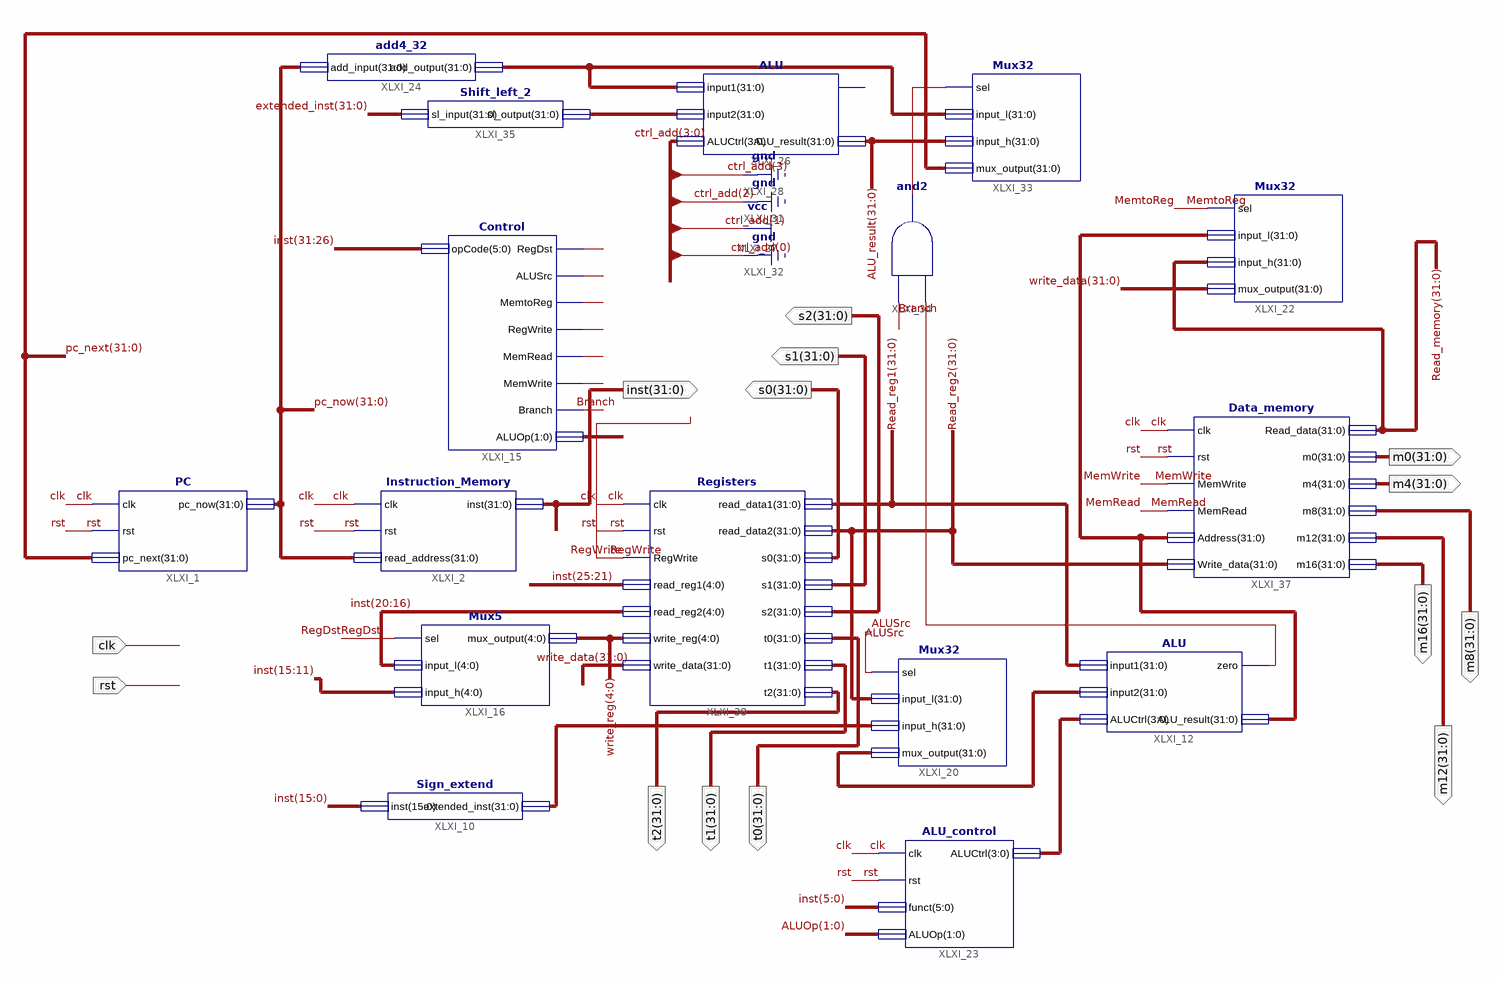
[diagram p0: schematic sheet 1]
// Xilinx ISE schematic theProcessor.sch (xa9500xl) as structural Verilog: 16 symbols, 14 ports
module theProcessor (
  input  clk,
  input  rst,
  output [31:0] inst,
  output [31:0] m0,
  output [31:0] m4,
  output [31:0] m8,
  output [31:0] m12,
  output [31:0] m16,
  output [31:0] t2,
  output [31:0] t1,
  output [31:0] t0,
  output [31:0] s2,
  output [31:0] s1,
  output [31:0] s0
);

  wire ALUSrc, Branch, MemRead, MemtoReg, MemWrite, RegDst, RegWrite, XLXN_137, XLXN_139;
  wire [1:0] ALUOp;
  wire [3:0] XLXN_101;
  wire [4:0] write_reg;
  wire [31:0] ALU_result, extended_inst, pc_next, pc_now, Read_memory, Read_reg1, Read_reg2, write_data,
       XLXN_63, XLXN_66, XLXN_132, XLXN_144;

  PC XLXI_1 (.clk(clk), .rst(rst), .pc_next(pc_next), .pc_now(pc_now));
  Instruction_Memory XLXI_2 (.clk(clk), .rst(rst), .read_address(pc_now), .inst(inst));
  Sign_extend XLXI_10 (.inst(inst[15:0]), .extended_inst(extended_inst));
  ALU XLXI_12 (.input1(Read_reg1), .input2(XLXN_63), .ALUCtrl(XLXN_101), .zero(XLXN_137), .ALU_result(XLXN_66));
  Mux5 XLXI_16 (.sel(RegDst), .input_l(inst[20:16]), .input_h(inst[15:11]), .mux_output(write_reg));
  Mux32 XLXI_20 (.sel(ALUSrc), .input_l(Read_reg2), .input_h(extended_inst), .mux_output(XLXN_63));
  Mux32 XLXI_22 (.sel(MemtoReg), .input_l(XLXN_66), .input_h(Read_memory), .mux_output(write_data));
  ALU_control XLXI_23 (.clk(clk), .rst(rst), .funct(inst[5:0]), .ALUOp(ALUOp), .ALUCtrl(XLXN_101));
  add4_32 XLXI_24 (.add_input(pc_now), .add_output(XLXN_132));
  Control XLXI_15 (
    .opCode(inst[31:26]), .RegDst(RegDst), .ALUSrc(ALUSrc), .MemtoReg(MemtoReg), .RegWrite(RegWrite),
    .MemRead(MemRead), .MemWrite(MemWrite), .Branch(Branch), .ALUOp(ALUOp));
  ALU XLXI_26 (.input1(XLXN_132), .input2(XLXN_144), .ALUCtrl(4'b0010), .ALU_result(ALU_result));  // open: zero
  Mux32 XLXI_33 (.sel(XLXN_139), .input_l(XLXN_132), .input_h(ALU_result), .mux_output(pc_next));
  and XLXI_34 (XLXN_139, XLXN_137, Branch);
  Shift_left_2 XLXI_35 (.sl_input(extended_inst), .sl_output(XLXN_144));
  Data_memory XLXI_37 (
    .clk(clk), .rst(rst), .MemWrite(MemWrite), .MemRead(MemRead), .Address(XLXN_66), .Write_data(Read_reg2),
    .Read_data(Read_memory), .m0(m0), .m4(m4), .m8(m8), .m12(m12), .m16(m16));
  Registers XLXI_38 (
    .clk(clk), .rst(rst), .RegWrite(RegWrite), .read_reg1(inst[25:21]), .read_reg2(inst[20:16]),
    .write_reg(write_reg), .write_data(write_data), .read_data1(Read_reg1), .read_data2(Read_reg2), .s0(s0),
    .s1(s1), .s2(s2), .t0(t0), .t1(t1), .t2(t2));
endmodule
